# Altium project MixDivSH.PrjPcb
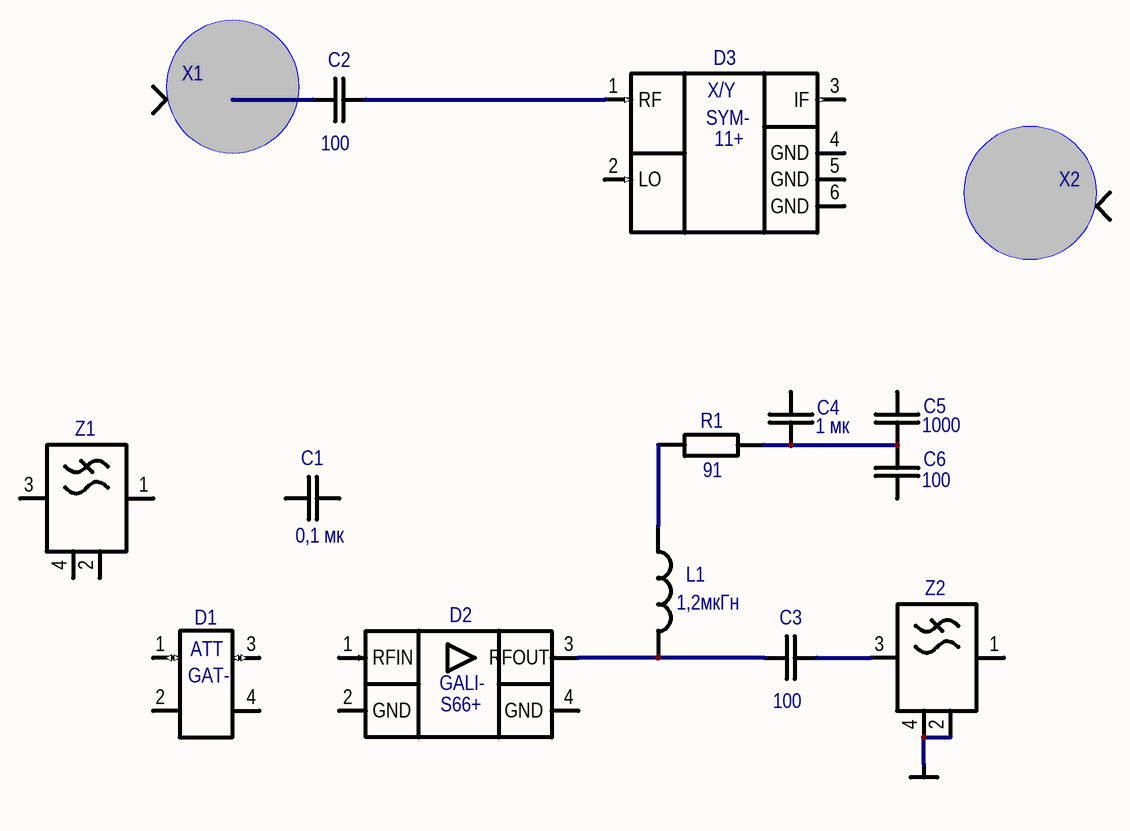
[diagram p0: MixBoard.SchDoc]
1 sheet, 16 parts. Net scope: global (net labels, ports and power ports of the same name join across sheets).

## Sheet MixBoard.SchDoc
size A3; SheetNumber: 1

### Parts
*  GND  (value not drawn)  (graphical)
C1  0,1 мк  [CAPC1608L]
C2  100  [CAPC1608L]
C3  100  [CAPC1608L]
C4  1 мк  [CAPC2012L]
C5  1000  [CAPC1608L]
C6  100  [CAPC1608L]
D1  (no value)  [MW_GAT-0]
D2  GALI-S66+  [SOT89-150P400X160-3N]  (value not drawn)
D3  SYM-11+  [MW_SYM-25DLHW]  (value not drawn)
L1  1,2мкГн  [INDC4532L]
R1  91  [RESC2012L]
X1  22_SMA-50-0-15/111_NE  [TP0.8X1.5]  (value not drawn)
X2  22_SMA-50-0-15/111_NE  [TP0.8X1.5]  (value not drawn)
Z1  LFCN-95+  [FIL_3216x9.4]  (value not drawn)
Z2  LFCN-95+  [FIL_3216x9.4]  (value not drawn)

### Nets
GND: Z2.2(Ground) Z2.4(Ground)
NetC2_1: C2.1 D3.1(RF)
NetC2_2: C2.2 X1.1
NetC3_1: C3.1 Z2.3(Out)
NetC3_2: C3.2 D2.3(RFOUT) L1.2
NetC4_1: C4.1 C5.1 C6.2 R1.1
NetL1_1: L1.1 R1.2

Not connected (* = marked no-connect by the designer): C1 1 2; C4 2; C5 2; C6 1; D1 1(IN) 2(GND) 3(OUT) 4(GND); D2 1(RFIN) 2(GND) 4(GND); D3 2(LO) 3(IF) 4(GND) 5(GND) 6(GND); X2 1; Z1 1(In) 2(Ground) 3(Out) 4(Ground); Z2 1(In)

### Notes on the sheet
- (in symbol GALI-S66+) GALI-; S66+
- (in symbol GAT) ATT; GAT-
- (in symbol SYM-11+) X/Y; SYM-; 11+

### Library data of the parts
* = GND: Корпус ЕСКД. Для "наложения" на штатный Power Bar
C1 = i6124B5A08701E000001: Чип-конденсатор; ManufacturerPartNumber: 0603 X7R 0,1 мкФ ±10 % 50 В; Name: 0603; Power/Voltage: 50 В; TKE/TKC: {TKE/TKC}; Tolerance: ±10 %; PCADSymbol: C; PCADLibrary: PASSIV.LIB; BCPId: *; Manufacturer: *; Type: Конденсатор; Value: 0,1 мк; ImKey: i6124B5A08701E000001; PCADType: C0603; PCADPattern: C0603
C2 C3 C6 = i6124B5A08701A000014: Чип-конденсатор; ManufacturerPartNumber: 0603 NP0 100 пФ ±5 % 50 В; Name: 0603; Power/Voltage: 50 В; TKE/TKC: NP0; Tolerance: ±5 %; BCPId: *; Manufacturer: *; Type: Конденсатор; Value: 100; ImKey: i6124B5A08701A000014
C4 = i6124B5A0870C4000011: Чип-конденсатор; ManufacturerPartNumber: 0805 X7R 1 мкФ ±10 % 50 В; Name: 0805; Power/Voltage: 50 В; TKE/TKC: {TKE/TKC}; Tolerance: ±10 %; PCADSymbol: C; PCADLibrary: PASSIV.LIB; BCPId: *; Manufacturer: *; Type: Конденсатор; Value: 1 мк; ImKey: i6124B5A0870C4000011; PCADType: C0805; PCADPattern: C0805
C5 = i6124B5A08701A000008: Чип-конденсатор; ManufacturerPartNumber: 0603 NP0 1000 пФ ±5 % 50 В; Name: 0603; Power/Voltage: 50 В; TKE/TKC: {TKE/TKC}; Tolerance: ±5 %; PCADSymbol: C; PCADLibrary: PASSIV.LIB; BCPId: *; Manufacturer: *; Type: Конденсатор; Value: 1000; ImKey: i6124B5A08701A000008; PCADType: C0603; PCADPattern: C0603
D1 = GAT: Fixed attenuator DC-8000; Manufacturer: Mini-Circuits; ManufacturerPartNumber: GAT-10+; Type: Микросхема; BCPId: *; Name: *; Package: FG873
D2 = GALI-S66+: Monolithic Amplifier 50Ω      DC to 3 GHz; Manufacturer: Mini-Circuits; Type: Микросхема; BCPId: *; Name: *; Package: DF782; ManufacturerPartNumber: GALI-S66+
D3 = SYM-11+: Frequency Mixer 1 to 2500 MHz; Manufacturer: Mini-Circuits; Type: Микросхема; BCPId: *; Name: *; Package: TTT167; ManufacturerPartNumber: SYM-11+
L1 = L1812: Индуктивность без магнитопровода; Manufacturer: CoilCraft; ManufacturerPartNumber: 1812CS-122XJL (1,2 мкГн ±5 %); Name: 1812; Tolerance: ±5 %; BCPId: *; Package: *; Type: Индуктивность; Value: 1,2мкГн
R1 = R0805: Чип-резистор; ManufacturerPartNumber: 0805 91 Ом ±5 %; Name: 0805; Tolerance: ±5 %; BCPId: *; Manufacturer: *; Type: Резистор; Value: 91
X1 X2 = 22_SMA-50-0-15/111_NE: Розетка герметичная; Manufacturer: HUBER+SUHNER; BCPId: *; ManufacturerPartNumber: 22_SMA-50-0-15/111_NE; Type: Розетка
Z1 Z2 = LFCN: Low Pass Filter; Manufacturer: Mini-Circuits; BCPId: *; Package: FV1206; Tolerance: *; ManufacturerPartNumber: LFCN-95+; Type: Фильтр